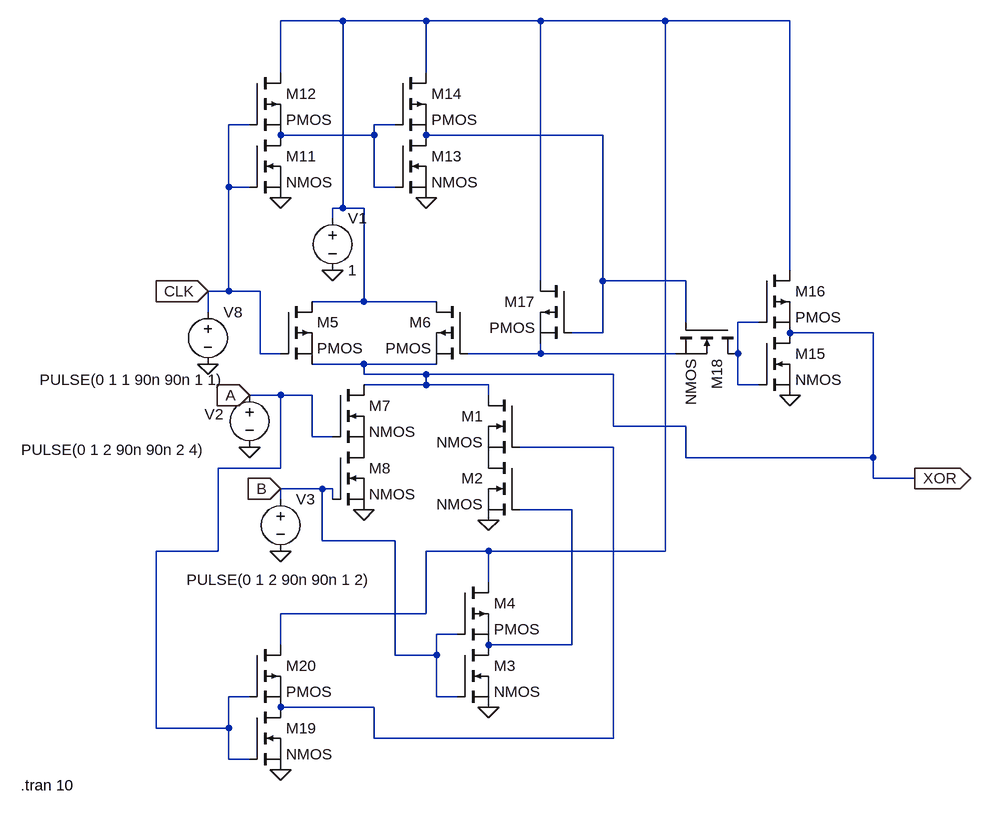
[diagram p0: schematic Draft5.asc]
Draft5.asc, the LTspice schematic file:
Version 4
SHEET 1 992 696
WIRE -192 -496 -288 -496
WIRE -64 -496 -192 -496
WIRE 112 -496 -64 -496
WIRE 304 -496 112 -496
WIRE 496 -496 304 -496
WIRE -288 -416 -288 -496
WIRE -64 -416 -64 -496
WIRE -336 -336 -368 -336
WIRE -112 -336 -144 -336
WIRE -144 -320 -144 -336
WIRE -144 -320 -288 -320
WIRE 208 -320 -64 -320
WIRE -368 -240 -368 -336
WIRE -336 -240 -368 -240
WIRE -144 -240 -144 -320
WIRE -112 -240 -144 -240
WIRE -192 -208 -192 -496
WIRE -192 -208 -208 -208
WIRE -160 -208 -192 -208
WIRE -208 -192 -208 -208
WIRE 496 -112 496 -496
WIRE 112 -96 112 -496
WIRE 208 -96 208 -320
WIRE 336 -96 208 -96
WIRE -368 -80 -368 -240
WIRE -368 -80 -400 -80
WIRE -320 -80 -368 -80
WIRE -160 -64 -160 -208
WIRE -160 -64 -240 -64
WIRE -48 -64 -160 -64
WIRE -400 -48 -400 -80
WIRE 336 -32 336 -96
WIRE 448 -32 416 -32
WIRE 208 -16 208 -96
WIRE 208 -16 160 -16
WIRE 624 -16 496 -16
WIRE -320 16 -320 -80
WIRE -288 16 -320 16
WIRE 112 16 112 0
WIRE 112 16 0 16
WIRE 320 16 112 16
WIRE 416 16 416 -32
WIRE -160 32 -240 32
WIRE -48 32 -160 32
WIRE -160 48 -160 32
WIRE -64 48 -160 48
WIRE 224 48 -64 48
WIRE -64 64 -64 48
WIRE -64 64 -160 64
WIRE 32 64 -64 64
WIRE 416 64 416 16
WIRE 448 64 416 64
WIRE -288 80 -336 80
WIRE -240 80 -288 80
WIRE 32 80 32 64
WIRE 224 128 224 48
WIRE 336 128 224 128
WIRE -240 144 -240 80
WIRE -208 144 -240 144
WIRE 224 160 80 160
WIRE 336 176 336 128
WIRE 624 176 624 -16
WIRE 624 176 336 176
WIRE -288 192 -288 80
WIRE -288 192 -384 192
WIRE 624 208 624 176
WIRE 688 208 624 208
WIRE -224 224 -288 224
WIRE -208 224 -224 224
WIRE -288 240 -288 224
WIRE -208 240 -208 224
WIRE 160 256 80 256
WIRE -224 304 -224 224
WIRE -112 304 -224 304
WIRE -384 320 -384 192
WIRE -384 320 -480 320
WIRE 32 320 -64 320
WIRE 304 320 304 -496
WIRE 304 320 32 320
WIRE 32 368 32 320
WIRE -64 416 -64 320
WIRE -64 416 -288 416
WIRE -16 448 -48 448
WIRE -288 464 -288 416
WIRE 160 464 160 256
WIRE 160 464 32 464
WIRE -112 480 -112 304
WIRE -48 480 -48 448
WIRE -48 480 -112 480
WIRE -336 544 -368 544
WIRE -48 544 -48 480
WIRE -16 544 -48 544
WIRE -144 560 -288 560
WIRE -480 592 -480 320
WIRE -368 592 -368 544
WIRE -368 592 -480 592
WIRE -144 608 -144 560
WIRE 224 608 224 160
WIRE 224 608 -144 608
WIRE -368 640 -368 592
WIRE -336 640 -368 640
FLAG -160 256 0
FLAG -208 -112 0
FLAG -336 160 0
FLAG -288 320 0
FLAG -288 -224 0
FLAG -64 -224 0
FLAG 496 80 0
FLAG -400 32 0
FLAG 32 272 0
FLAG 32 560 0
FLAG -288 656 0
FLAG 688 208 XOR
IOPIN 688 208 Out
FLAG -336 80 A
IOPIN -336 80 In
FLAG -288 224 B
IOPIN -288 224 In
FLAG -400 -80 CLK
IOPIN -400 -80 In
SYMBOL pmos -288 -64 R0
SYMATTR InstName M5
SYMBOL pmos 0 -64 M0
SYMATTR InstName M6
SYMBOL nmos -208 64 R0
SYMATTR InstName M7
SYMBOL nmos -208 160 R0
SYMATTR InstName M8
SYMBOL voltage -208 -208 R0
WINDOW 123 0 0 Left 0
WINDOW 39 0 0 Left 0
SYMATTR InstName V1
SYMATTR Value 1
SYMBOL voltage -336 64 R0
WINDOW 0 -69 45 Left 2
WINDOW 3 -351 100 Left 2
WINDOW 123 0 0 Left 0
WINDOW 39 0 0 Left 0
SYMATTR InstName V2
SYMATTR Value PULSE(0 1 2 90n 90n 2 4)
SYMBOL voltage -288 224 R0
WINDOW 3 -145 140 Left 2
WINDOW 123 0 0 Left 0
WINDOW 39 0 0 Left 0
SYMATTR Value PULSE(0 1 2 90n 90n 1 2)
SYMATTR InstName V3
SYMBOL nmos -336 -320 R0
SYMATTR InstName M11
SYMBOL pmos -336 -416 R0
SYMATTR InstName M12
SYMBOL nmos -112 -320 R0
SYMATTR InstName M13
SYMBOL pmos -112 -416 R0
SYMATTR InstName M14
SYMBOL nmos 448 -16 R0
SYMATTR InstName M15
SYMBOL pmos 448 -112 R0
SYMATTR InstName M16
SYMBOL voltage -400 -64 R0
WINDOW 3 -259 120 Left 2
WINDOW 123 0 0 Left 0
WINDOW 39 0 0 Left 0
SYMATTR InstName V8
SYMATTR Value PULSE(0 1 1 90n 90n 1 1)
SYMBOL pmos 160 -96 M0
SYMATTR InstName M17
SYMBOL nmos 416 -32 R90
SYMATTR InstName M18
SYMBOL nmos 80 80 M0
SYMATTR InstName M1
SYMBOL nmos 80 176 M0
SYMATTR InstName M2
SYMBOL nmos -16 464 R0
SYMATTR InstName M3
SYMBOL pmos -16 368 R0
SYMATTR InstName M4
SYMBOL nmos -336 560 R0
SYMATTR InstName M19
SYMBOL pmos -336 464 R0
SYMATTR InstName M20
TEXT -688 680 Left 2 !.tran 10

The netlist it stands for:
* Draft5.asc
M5 N001 CLK XOR XOR PMOS
M6 N001 N005 XOR XOR PMOS
M7 XOR A P001 P001 NMOS
M8 P001 B 0 0 NMOS
V1 N001 0 1
V2 A 0 PULSE(0 1 2 90n 90n 2 4)
V3 B 0 PULSE(0 1 2 90n 90n 1 2)
M11 N002 CLK 0 0 NMOS
M12 N001 CLK N002 N002 PMOS
M13 N003 N002 0 0 NMOS
M14 N001 N002 N003 N003 PMOS
M15 XOR N004 0 0 NMOS
M16 N001 N004 XOR XOR PMOS
V8 CLK 0 PULSE(0 1 1 90n 90n 1 1)
M17 N001 N003 N005 N005 PMOS
M18 N004 N003 N005 N005 NMOS
M1 XOR N006 P002 P002 NMOS
M2 P002 N007 0 0 NMOS
M3 N007 B 0 0 NMOS
M4 N001 B N007 N007 PMOS
M19 N006 A 0 0 NMOS
M20 N001 A N006 N006 PMOS
.model NMOS NMOS
.model PMOS PMOS
.lib standard.mos
.tran 10
.backanno
.end